# EasyEDA schematic buckConverter.json
TITLE: Sheet_1; REV: 1.0; Date: 2024-05-12; Sheet: 1/1; Company: Your Company
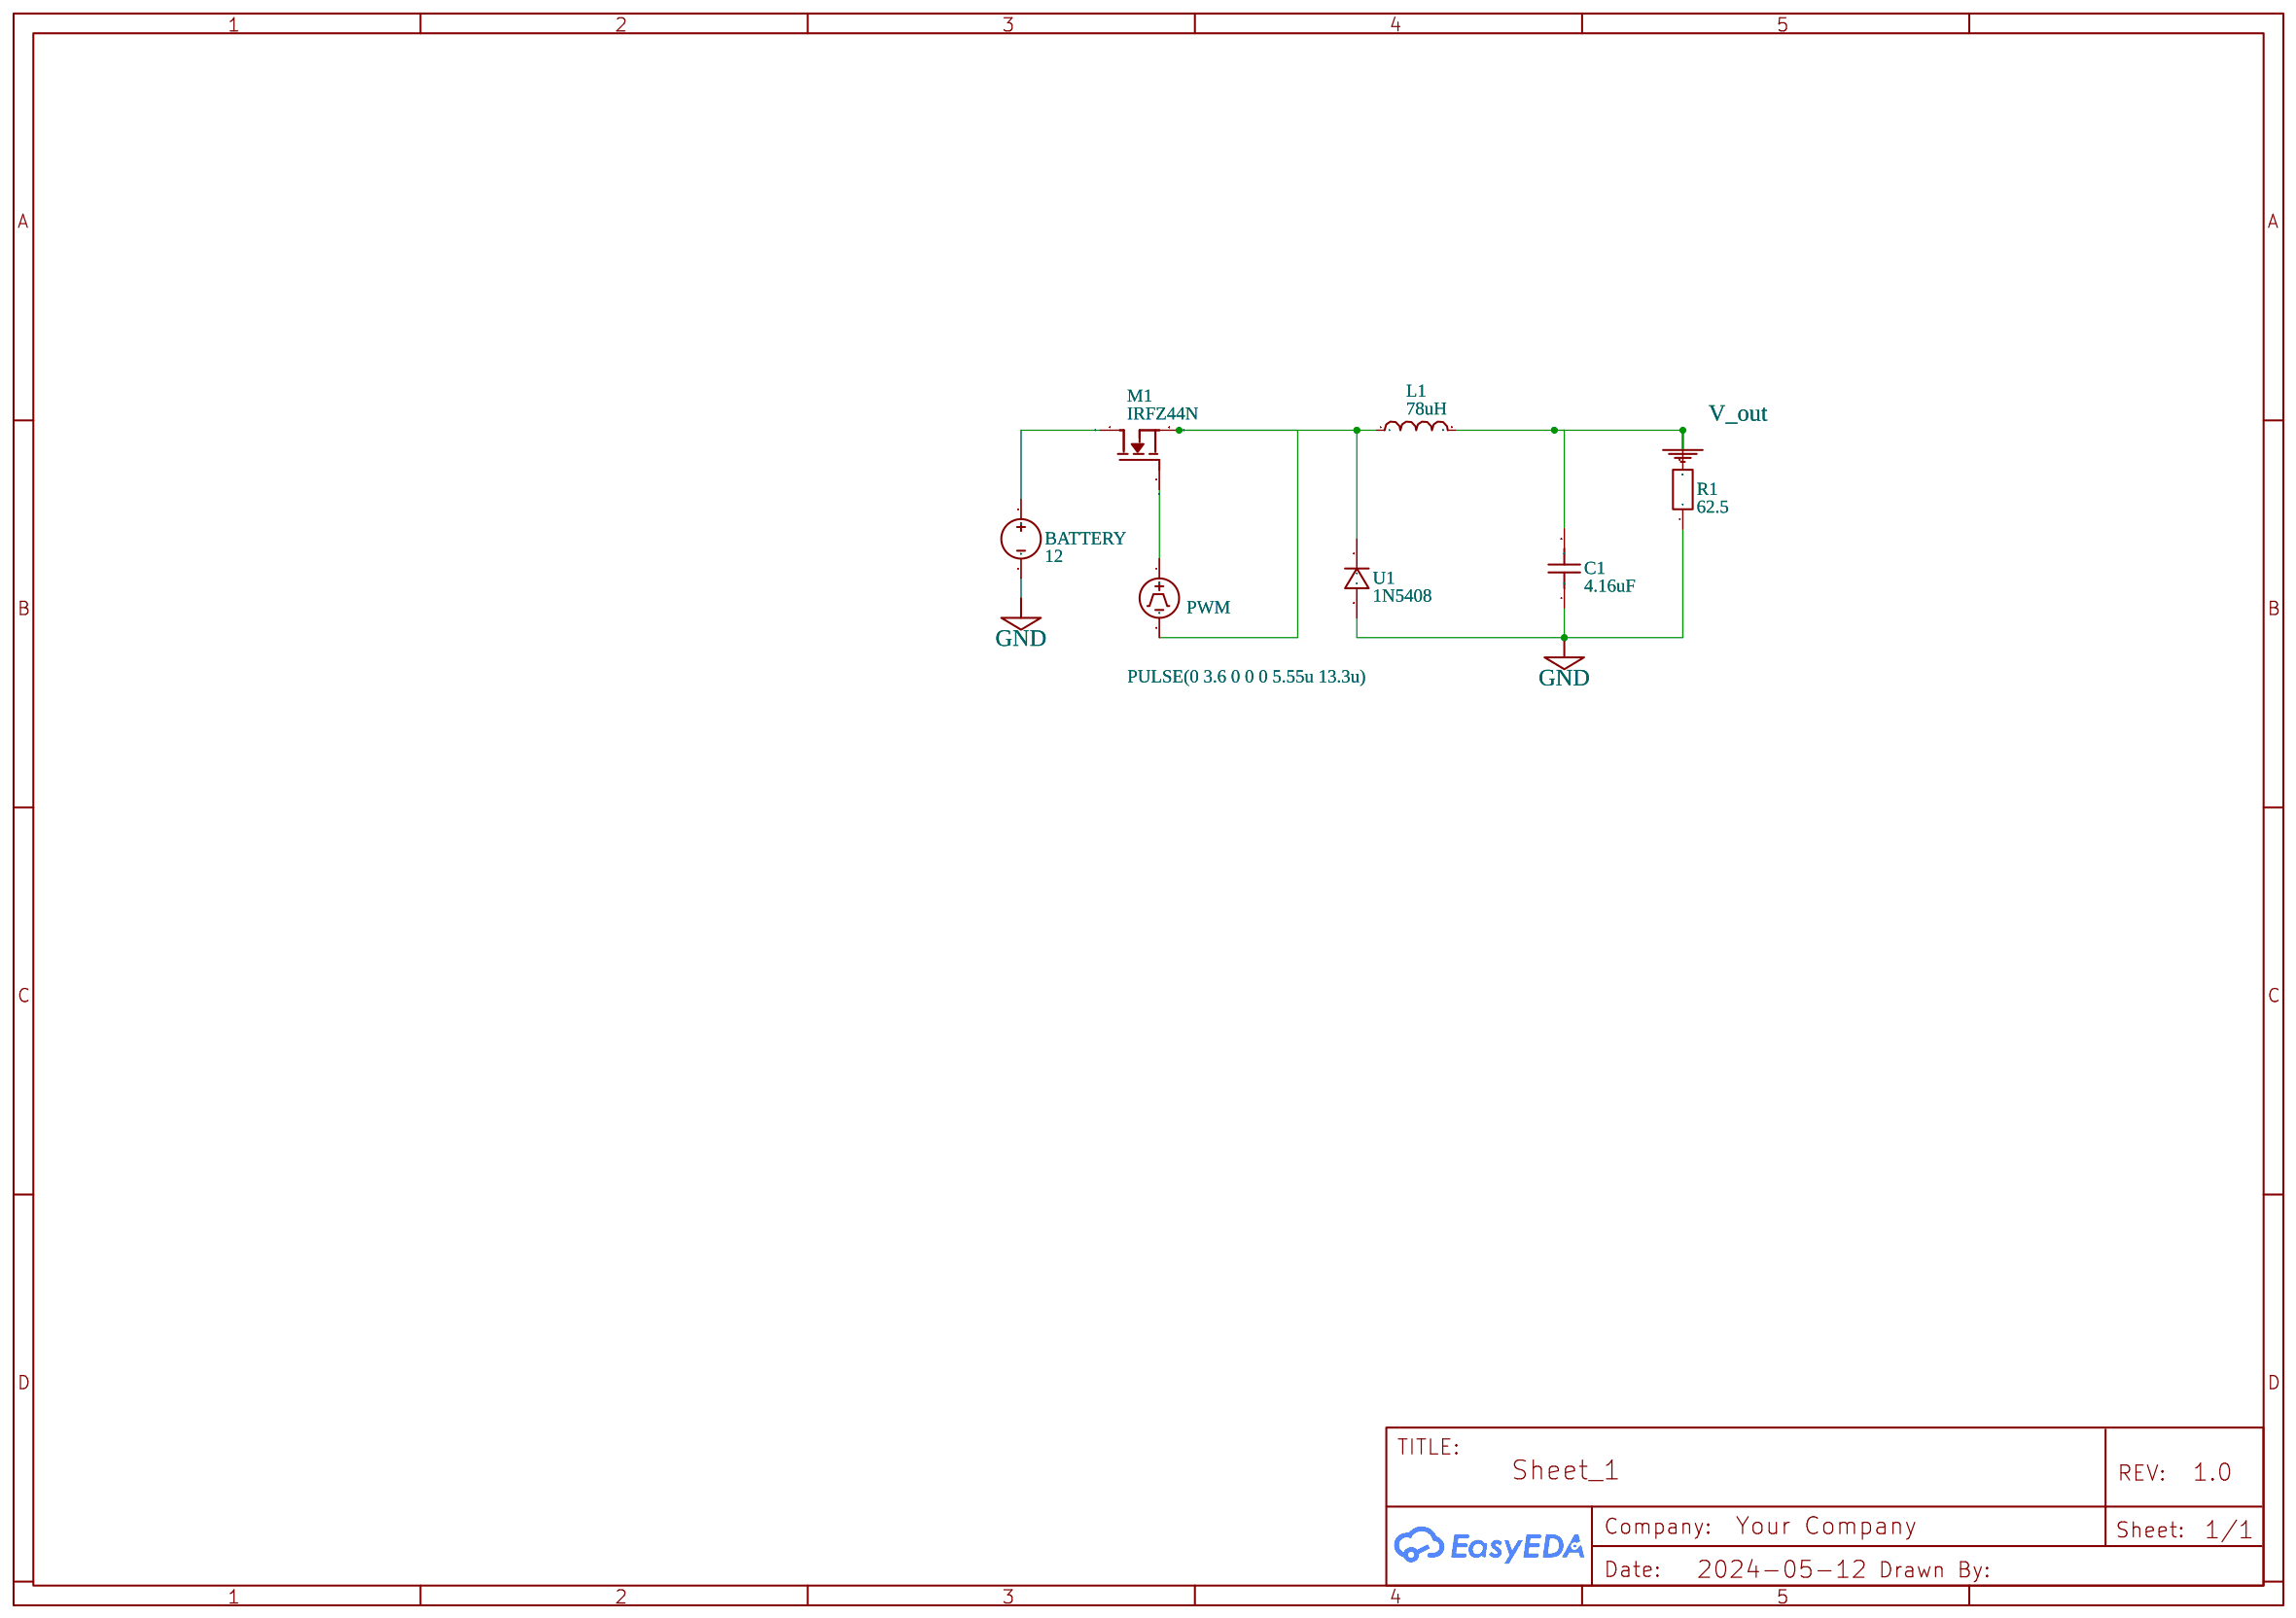
[diagram p0: schematic sheet]

## Parts
BATTERY  12  [HDR1X2]
C1  4.16uF  [RAD-0.1]
L1  78uH  [AXIAL-0.4]
M1  IRFZ44N  [TO-220]
PWM  PULSE(0 3.6 0 0 0 5.55u 13.3u)  [HDR1X2]
R1  62.5  [AXIAL-0.3]
U1  1N5408

## Library data of the parts
BATTERY = VDC: Contributor: EasyEDA; sim: true
C1 = Capacitor_US: Contributor: EasyEDA; Supplier: YUJING; Capacitance: 1u
L1 = Inductor: Supplier: YUJING; Contributor: EasyEDA; Inductance: 1m
M1 = IRFZ44N: link: http://www.infineon.com/dgdl/irf3205pbf.pdf?fileId=5546d462533600a4015355def244190a; sim: true; Contributor: harryseldon
PWM = VPULSE: Contributor: EasyEDA; sim: true
R1 = Resistor_EU: Contributor: EasyEDA; Resistance: 1K
U1 = 1N5408: catid: 20; Contributor: kuk.13025; sim: true

## Nets
GND: BATTERY.2 C1.1 R1.1 U1.1(A)
V_out: C1.2 L1.2 R1.2
Net-(BATTERY-1): BATTERY.1 M1.2(D)
Net-(L1-1): L1.1 M1.3(S) PWM.2 U1.2(K)
Net-(M1-1): M1.1(G) PWM.1
